# Altium schematic sheet M Sub2.SchDoc
size A; SheetNumber: 4; SheetTotal: 10
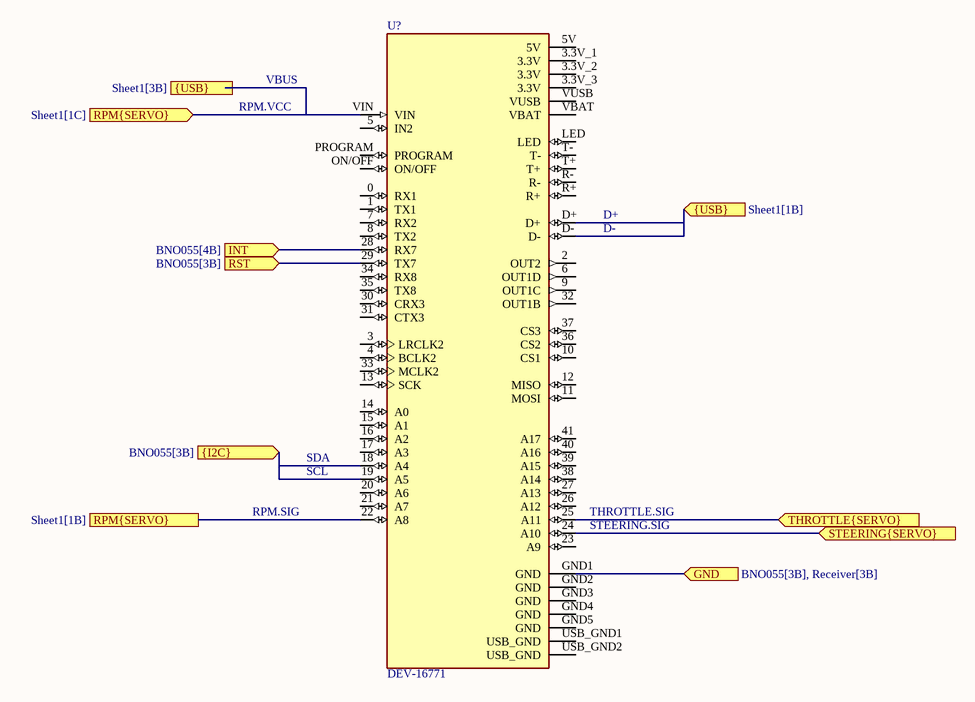
[diagram p0: M Sub2.SchDoc]

## Parts
U?  DEV-16771  [MODULE_DEV-16771]

## Ports
GND (in, see BNO055[3B], Receiver[3B]), INT (in, see BNO055[4B]), RPM{SERVO} (in, see Sheet1[1C]), RPM{SERVO} (see Sheet1[1B]), RST (in, see BNO055[3B]), STEERING{SERVO} (in), THROTTLE{SERVO} (in), {I2C} (in, see BNO055[3B]), {USB} (in, see Sheet1[1B]), {USB} (in, see Sheet1[3B])

## Nets
GND: U?.GND1(GND) ; port GND
INT: U?.28(RX7) ; port INT
RST: U?.29(TX7) ; port RST

Not connected (* = marked no-connect by the designer): U? 0(RX1) 1(TX1) 2(OUT2) 3(LRCLK2) 3.3V_1(3.3V) 3.3V_2(3.3V) 3.3V_3(3.3V) 4(BCLK2) 5(IN2) 5V 6(OUT1D) 7(RX2) 8(TX2) 9(OUT1C) 10(CS1) 11(MOSI) 12(MISO) 13(SCK) 14(A0) 15(A1) 16(A2) 17(A3) 18(A4) 19(A5) 20(A6) 21(A7) 22(A8) 23(A9) 24(A10) 25(A11) 26(A12) 27(A13) 30(CRX3) 31(CTX3) 32(OUT1B) 33(MCLK2) 34(RX8) 35(TX8) 36(CS2) 37(CS3) 38(A14) 39(A15) 40(A16) 41(A17) D+ D- GND2(GND) GND3(GND) GND4(GND) GND5(GND) LED ON/OFF PROGRAM R+ R- T+ T- USB_GND1(USB_GND) USB_GND2(USB_GND) VBAT VIN VUSB

## Buses and harness runs
bus port RPM{SERVO} = port {USB}

## Notes on the sheet
- RPM.VCC
- VBUS
- D+
- D-
- SDA
- RPM.SIG
- SCL
- (near U?) STEERING.SIG
- (near U?) THROTTLE.SIG

## Library data of the parts
U? = CMP-010-000000-1: RT1062 Teensy 4.1 series ARM® Cortex®-M7 MPU Embedded Evaluation Board; MF: SparkFun Electronics; MP: DEV-16771; Pin Count: 65; Check_prices: https://www.snapeda.com/parts/DEV-16771/SparkFun+Electronics/view-part/?ref=eda; Value: *; Component Type: Standard; SnapEDA_Link: https://www.snapeda.com/parts/DEV-16771/SparkFun+Electronics/view-part/?ref=snap; Source: DEV-16771.SchLib; Package: None; Design Item ID: DEV-16771